# Altium schematic sheet MotorCell.SchDoc
size A3; DocumentNumber: 1; SheetNumber: 3; SheetTotal: 5; SPICEModelCache: <root> / <DocumentId>HIQXUUEP</DocumentId> / <CacheFrame Number="0"> / <Model Name="6050_7447786122_22u" Kind="CKT"> / <Text>******* / .subckt 6050_7447786122_22u 1 2 / Rp 1 2 17374.7513097 / Cp 1 2 5.64102666619p / Rs 1 N3 0.098 / L1 N3 2 19.6300919502u / .ends 6050_7447786122_22u</Text> / </Model> / </CacheFrame> / </root>
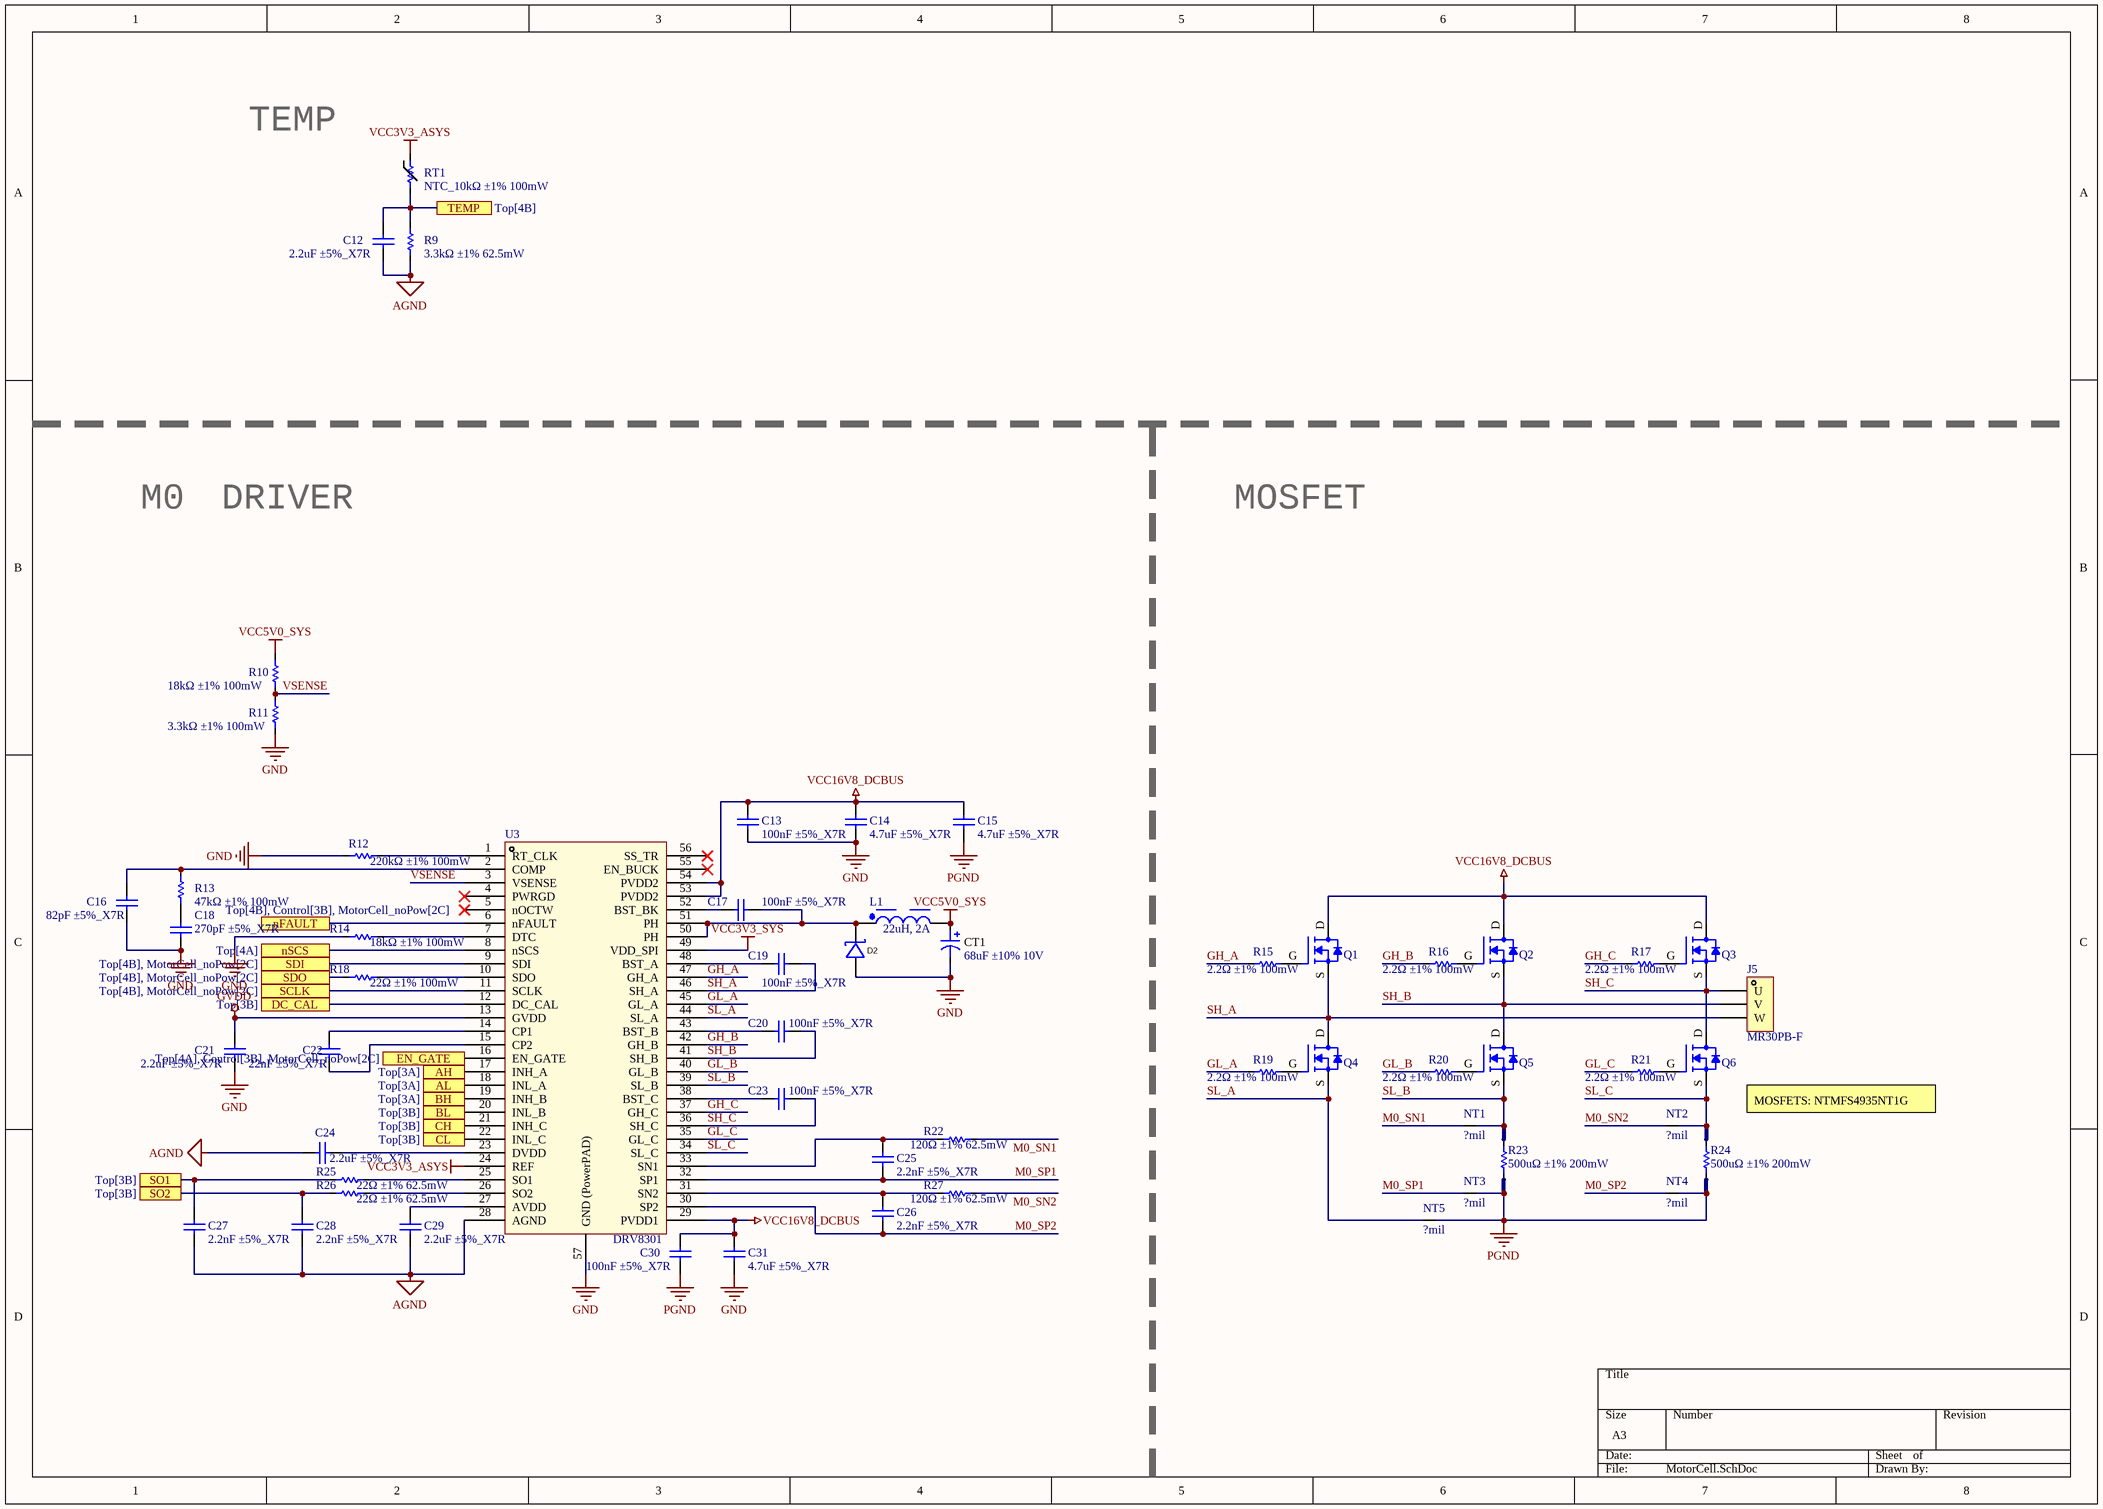
[diagram p0: MotorCell.SchDoc]

## Parts
C12  2.2uF ±5%_X7R  [C0402]
C13  100nF ±5%_X7R  [C0402]
C14  4.7uF ±5%_X7R  [C0603]
C15  4.7uF ±5%_X7R  [C0603]
C16  82pF ±5%_X7R  [C0402]
C17  100nF ±5%_X7R  [C0402]
C18  270pF ±5%_X7R  [C0402]
C19  100nF ±5%_X7R  [C0402]
C20  100nF ±5%_X7R  [C0402]
C21  2.2uF ±5%_X7R  [C0603]
C22  22nF ±5%_X7R  [C0603]
C23  100nF ±5%_X7R  [C0402]
C24  2.2uF ±5%_X7R  [C0603]
C25  2.2nF ±5%_X7R  [C0402]
C26  2.2nF ±5%_X7R  [C0402]
C27  2.2nF ±5%_X7R  [C0402]
C28  2.2nF ±5%_X7R  [C0402]
C29  2.2uF ±5%_X7R  [C0603]
C30  100nF ±5%_X7R  [C0402]
C31  4.7uF ±5%_X7R  [C0603]
CT1  68uF ±10% 10V  [CAP-SMD-R-RD]
D2  B340A-13-F  [SMA_L4.4-W2.6-LS5.0-RD]  (value not drawn)
J5  MR30PB-F  [MR30PB-F [Straight] [SMT]]
L1  22uH, 2A  [WE-PD_6050R]
NT1  ?mil  [NETTIE_8mil]  (net tie, no BOM)
NT2  ?mil  [NETTIE_8mil]  (net tie, no BOM)
NT3  ?mil  [NETTIE_8mil]  (net tie, no BOM)
NT4  ?mil  [NETTIE_8mil]  (net tie, no BOM)
NT5  ?mil  [NETTIE_8mil]  (net tie, no BOM)
Q1  NTMFS4935NT1G  [NRVTS10100EMFST1G]  (value not drawn)
Q2  NTMFS4935NT1G  [NRVTS10100EMFST1G]  (value not drawn)
Q3  NTMFS4935NT1G  [NRVTS10100EMFST1G]  (value not drawn)
Q4  NTMFS4935NT1G  [NRVTS10100EMFST1G]  (value not drawn)
Q5  NTMFS4935NT1G  [NRVTS10100EMFST1G]  (value not drawn)
Q6  NTMFS4935NT1G  [NRVTS10100EMFST1G]  (value not drawn)
R9  3.3kΩ ±1% 62.5mW  [R0402]
R10  18kΩ ±1% 100mW  [R0402]
R11  3.3kΩ ±1% 100mW  [R0402]
R12  220kΩ ±1% 100mW  [R0402]
R13  47kΩ ±1% 100mW  [R0402]
R14  18kΩ ±1% 100mW  [R0402]
R15  2.2Ω ±1% 100mW  [R0402]
R16  2.2Ω ±1% 100mW  [R0402]
R17  2.2Ω ±1% 100mW  [R0402]
R18  22Ω ±1% 100mW  [R0402]
R19  2.2Ω ±1% 100mW  [R0402]
R20  2.2Ω ±1% 100mW  [R0402]
R21  2.2Ω ±1% 100mW  [R0402]
R22  120Ω ±1% 62.5mW  [R0402]
R23  500uΩ ±1% 200mW  [R2512]
R24  500uΩ ±1% 200mW  [R2512]
R25  22Ω ±1% 62.5mW  [R0402]
R26  22Ω ±1% 62.5mW  [R0402]
R27  120Ω ±1% 62.5mW  [R0402]
RT1  NTC_10kΩ ±1% 100mW  [R0402]
U3  DRV8301  [TSSOP50P810X120_HS-57N]

## Ports
AH (see Top[3A]), AL (see Top[3A]), BH (see Top[3A]), BL (see Top[3B]), CH (see Top[3B]), CL (see Top[3B]), DC_CAL (see Top[3B]), EN_GATE (see Top[4A], Control[3B], MotorCell_noPow[2C]), nFAULT (see Top[4B], Control[3B], MotorCell_noPow[2C]), nSCS (see Top[4A]), SCLK (see Top[4B], MotorCell_noPow[2C]), SDI (see Top[4B], MotorCell_noPow[2C]), SDO (see Top[4B], MotorCell_noPow[2C]), SO1 (see Top[3B]), SO2 (see Top[3B]), TEMP (see Top[4B])

## Nets
AGND: C12.1 C24.2 C27.1 C28.1 C29.1 R9.2 U3.28(AGND)
GND: C13.1 C14.1 C16.1 C18.1 C21.1 C31.1 CT1.2 D2.2(A) R11.1 R12.2 R14.2 U3.57(GND_(PowerPAD))
GVDD: C21.2 U3.13(GVDD)
PGND: C15.1 C30.1 NT3.2 NT4.2 NT5.2 R23.1 R24.1
VCC3V3_ASYS: RT1.1 U3.24(REF)
VCC3V3_SYS: U3.49(VDD_SPI)
VCC5V0_SYS: CT1.1 L1.2 R10.2
VCC16V8_DCBUS: C13.2 C14.2 C15.2 C30.2 C31.2 Q1.D Q2.D Q3.D U3.29(PVDD1) U3.53(PVDD2) U3.54(PVDD2)
AH: U3.17(INH_A) ; port AH
AL: U3.18(INL_A) ; port AL
BH: U3.19(INH_B) ; port BH
BL: U3.20(INL_B) ; port BL
CH: U3.21(INH_C) ; port CH
CL: U3.22(INL_C) ; port CL
DC_CAL: U3.12(DC_CAL) ; port DC_CAL
EN_GATE: U3.16(EN_GATE) ; port EN_GATE
GH_A: R15.1 U3.47(GH_A)
GH_B: R16.1 U3.42(GH_B)
GH_C: R17.1 U3.37(GH_C)
GL_A: R19.1 U3.45(GL_A)
GL_B: R20.1 U3.40(GL_B)
GL_C: R21.1 U3.35(GL_C)
M0_SN1: NT1.1 R22.1
M0_SN2: NT2.1 R27.1
M0_SP1: C25.1 NT3.1 U3.32(SP1)
M0_SP2: C26.1 NT4.1 U3.30(SP2)
nFAULT: U3.6(nFAULT) ; port nFAULT
nSCS: U3.8(nSCS) ; port nSCS
SCLK: U3.11(SCLK) ; port SCLK
SDI: U3.9(SDI) ; port SDI
SDO: R18.1 ; port SDO
SH_A: C19.1 J5.3(W) Q1.S Q4.D U3.46(SH_A)
SH_B: C20.1 J5.2(V) Q2.S Q5.D U3.41(SH_B)
SH_C: C23.1 J5.1(U) Q3.S Q6.D U3.36(SH_C)
SL_A: NT5.1 Q4.S U3.44(SL_A)
SL_B: NT1.2 Q5.S R23.2 U3.39(SL_B)
SL_C: NT2.2 Q6.S R24.2 U3.34(SL_C)
SO1: C27.2 R25.2 ; port SO1
SO2: C28.2 R26.2 ; port SO2
TEMP: C12.2 R9.1 RT1.2 ; port TEMP
VSENSE: R10.1 R11.2 U3.3(VSENSE)
NetC16_2: C16.2 R13.2 U3.2(COMP)
NetC17_1: C17.1 D2.1(K) L1.1 U3.50(PH) U3.51(PH)
NetC17_2: C17.2 U3.52(BST_BK)
NetC18_2: C18.2 R13.1
NetC19_2: C19.2 U3.48(BST_A)
NetC20_2: C20.2 U3.43(BST_B)
NetC22_1: C22.1 U3.14(CP1)
NetC22_2: C22.2 U3.15(CP2)
NetC23_2: C23.2 U3.38(BST_C)
NetC24_1: C24.1 U3.23(DVDD)
NetC25_2: C25.2 R22.2 U3.33(SN1)
NetC26_2: C26.2 R27.2 U3.31(SN2)
NetC29_2: C29.2 U3.27(AVDD)
NetQ1_G: Q1.G R15.2
NetQ2_G: Q2.G R16.2
NetQ3_G: Q3.G R17.2
NetQ4_G: Q4.G R19.2
NetQ5_G: Q5.G R20.2
NetQ6_G: Q6.G R21.2
NetR12_1: R12.1 U3.1(RT_CLK)
NetR14_1: R14.1 U3.7(DTC)
NetR18_2: R18.2 U3.10(SDO)
NetR25_1: R25.1 U3.25(SO1)
NetR26_1: R26.1 U3.26(SO2)

Not connected (* = marked no-connect by the designer): U3 4(PWRGD)* 5(nOCTW)* 55(EN_BUCK)* 56(SS_TR)*

## Notes on the sheet
- TEMP
- M0
- DRIVER
- MOSFET
- MOSFETS: NTMFS4935NT1G

## Library data of the parts
C12-C31 = Cap: Capacitor; Published: 8-Jun-2000; LatestRevisionDate: 17-Jul-2002; LatestRevisionNote: Re-released for DXP Platform.; PackageReference: RAD-0.3; Publisher: Altium Limited; PackageDescription: Radial Cap, Thru-Hole; 2 Leads; 0.3 in Pin Spacing
CT1 = Cap TANT: 容值:330uF;精度:±20%;额定电压:6.3V;等效串联电阻:-;; Manufacturer: 湘怡中元/湘江; Name: 330uF; Symbol: CA45-C6R3M337T; Add into BOM: yes; Value: 330uF; Tolerance: ±20%; Rated Voltage: 6.3V; Device: CA45-C6R3M337T; LCSC Part Name: 330uF ±20% 6.3V; Supplier Part: C2832686; Manufacturer Part: CA45-C6R3M337T; Supplier Footprint: CASE-A-2312; JLCPCB Part Class: 扩展库; Datasheet: https://atta.szlcsc.com/upload/public/pdf/source/20191009/C435293_78A410F3D73489DBEAC46056C4262F7A.pdf; Supplier: LCSC; Convert to PCB: yes; Leakage Current(DCL): -; Ripple Current: -; Equivalent Series Resistance(ESR): -
D2 = Diode_Schottky: 直流反向耐压(Vr):40V;平均整流电流(Io):3A;正向压降(Vf):500mV@3A;; Manufacturer: DIODES(美台); Add into BOM: yes; Reverse Voltage (Vr): 40V; Average Rectified Current (Io): 3A; Name: B340A-13-F; Symbol: B340A-13-F; Device: B340A-13-F; LCSC Part Name: 40V 3A 500mV@3A; Supplier Part: C85098; Manufacturer Part: B340A-13-F; Supplier Footprint: SMA(DO-214AC); JLCPCB Part Class: 扩展库; Datasheet: https://atta.szlcsc.com/upload/public/pdf/source/20171023/C134454_15087453575121052549.pdf; Supplier: LCSC; Convert to PCB: yes; Forward Voltage (Vf@If): 500mV@3A
J5 = MR30PB-F [Straight] [SMT]: 驱动器端
L1 = 7447786122: WE-PD SMT Power Inductor, size 6050R, 22uH, 2A, 115mOhm; Manufacturer: Wurth Elektronik; DC Resistance: 98mOhm; Saturation Current: 1.3A; Self Resonant Frequency: 15MHz; Type: Robust; Manufacturer Part Number: 7447786122; Category: Power Inductors; Match Code: WE-PD; ComponentLink1Description: Website Link; ComponentLink1URL: https://www.we-online.com/redexpert/article/7447786122?ad; ComponentLink2Description: Datasheet Link; ComponentLink2URL: https://www.we-online.com/redexpert/spec/7447786122?ad; Mount: Surface Mount; Operating Temperature Max: 125°C; Operating Temperature Min: -40°C; Packaging: Tape and Reel; Case/Size Code: 6050R; Length: 5.9mm; Width: 6.2mm; Height: 5.1mm; DC Resistance Max: 115mOhm; Inductance: 22uH; Rated Current: 2A
NT1-NT5 = NETTIE
Q1-Q6 = MOSFET-N: MOSFET – Power, Single, / N-Channel, SO-8 FL / 30 V, 93 A; Manufacturer: ON Semiconductor; Drain to Source Voltage (Vdss): 30V; Current - Continuous Drain (Id) @ 25°C: 13A (Ta), 93A (Tc); Drive Voltage (Max Rds On,  Min Rds On): 4.5V, 10V; Vgs(th) (Max) @ Id: 2.2V @ 250µA; Gate Charge (Qg) (Max) @ Vgs: 49.4nC @ 10V; Input Capacitance (Ciss) (Max) @ Vds: 4850pF @ 15V; Vgs (Max): ±20V; Power Dissipation (Max): 930mW (Ta), 48W (Tc); Rds On (Max) @ Id, Vgs: 3.2 mOhm @ 30A, 10V; Supplier 1: Digi-Key; Supplier Part Number 1: NTMFS4935NT1GOSCT-ND; RoHS: RoHS Compliant; Category: Discrete Semiconductor Products; Stock 1: 932; Pricing 1: 1=0.61, 10=0.541, 100=0.4145, 500=0.3277 (USD); Packaging: Cut Tape (CT); Part Status: Active; FET Type: N-Channel; Technology: MOSFET (Metal Oxide); FET Feature: -; Operating Temperature: -55°C ~ 150°C (TJ); Mounting Type: Surface Mount; Supplier Device Package: 5-DFN (5x6) (8-SOFL); Package / Case: 8-PowerTDFN, 5 Leads; ComponentLink1URL: http://www.onsemi.com/pub_link/Collateral/NTMFS4935N-D.PDF; ComponentLink1Description: http://www.onsemi.com/pub_link/Collateral/NTMFS4935N-D.PDF; Manufacturer Part Number: NTMFS4935NT1G
R9-R27 = Res: Resistor; Published: 8-Jun-2000; LatestRevisionDate: 17-Jul-2002; LatestRevisionNote: Re-released for DXP Platform.; PackageReference: AXIAL-0.3; Publisher: Altium Limited; PackageDescription: Axial Device, Thru-Hole; 2 Leads; 0.3 in Pin Spacing
RT1 = TEMP RES: THERMISTOR 10K OHM NTC 0402 SMD
U3 = DRV8301: MOTOR DRIVER, 3PH, 56HTSSOP